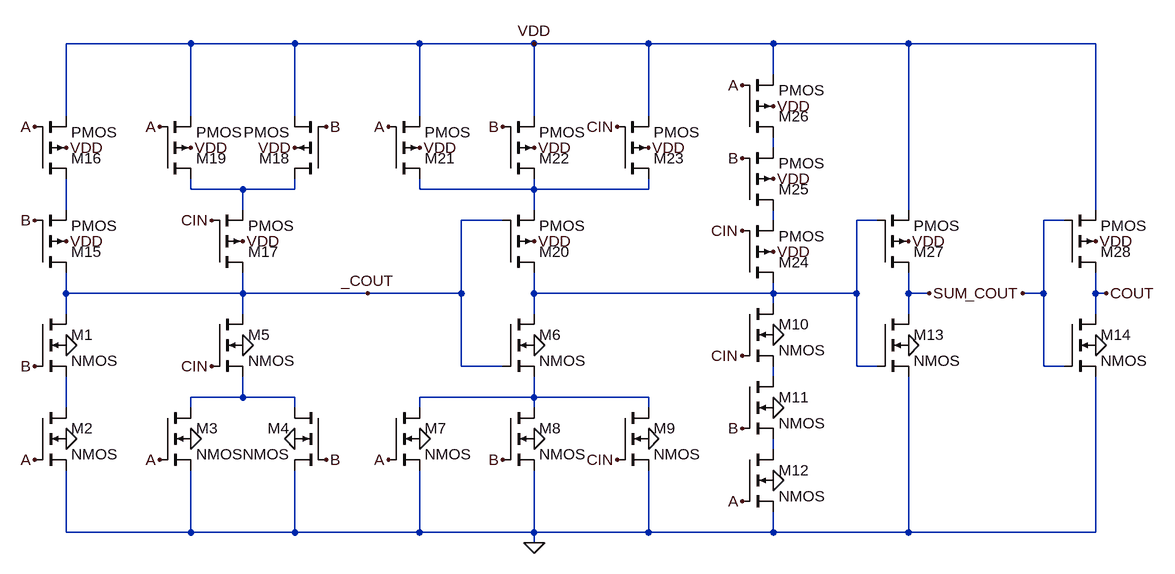
[diagram p0: schematic FA.asc]
FA.asc, the LTspice schematic file:
Version 4
SHEET 1 1760 680
WIRE -256 -368 -448 -368
WIRE -96 -368 -256 -368
WIRE 96 -368 -96 -368
WIRE 272 -368 96 -368
WIRE 448 -368 272 -368
WIRE 640 -368 448 -368
WIRE 848 -368 640 -368
WIRE 1136 -368 848 -368
WIRE 640 -320 640 -368
WIRE -448 -256 -448 -368
WIRE -256 -256 -256 -368
WIRE -96 -256 -96 -368
WIRE 96 -256 96 -368
WIRE 272 -256 272 -368
WIRE 448 -256 448 -368
WIRE 640 -208 640 -224
WIRE -256 -144 -256 -160
WIRE -176 -144 -256 -144
WIRE -96 -144 -96 -160
WIRE -96 -144 -176 -144
WIRE 96 -144 96 -160
WIRE 272 -144 272 -160
WIRE 272 -144 96 -144
WIRE 448 -144 448 -160
WIRE 448 -144 272 -144
WIRE -448 -112 -448 -160
WIRE -176 -112 -176 -144
WIRE 272 -112 272 -144
WIRE 848 -112 848 -368
WIRE 1136 -112 1136 -368
WIRE 224 -96 160 -96
WIRE 640 -96 640 -112
WIRE 800 -96 768 -96
WIRE 1088 -96 1056 -96
WIRE -448 16 -448 -16
WIRE -176 16 -176 -16
WIRE -176 16 -448 16
WIRE 16 16 -176 16
WIRE 160 16 160 -96
WIRE 160 16 16 16
WIRE 272 16 272 -16
WIRE 640 16 640 0
WIRE 640 16 272 16
WIRE 768 16 768 -96
WIRE 768 16 640 16
WIRE 848 16 848 -16
WIRE 880 16 848 16
WIRE 1056 16 1056 -96
WIRE 1056 16 1024 16
WIRE 1136 16 1136 -16
WIRE 1152 16 1136 16
WIRE 640 32 640 16
WIRE -448 48 -448 16
WIRE -176 48 -176 16
WIRE 272 48 272 16
WIRE 848 48 848 16
WIRE 1136 48 1136 16
WIRE 160 128 160 16
WIRE 224 128 160 128
WIRE 768 128 768 16
WIRE 800 128 768 128
WIRE 1056 128 1056 16
WIRE 1088 128 1056 128
WIRE 640 144 640 128
WIRE -176 176 -176 144
WIRE -176 176 -256 176
WIRE -96 176 -176 176
WIRE 272 176 272 144
WIRE 272 176 96 176
WIRE 448 176 272 176
WIRE -448 192 -448 144
WIRE -256 192 -256 176
WIRE -96 192 -96 176
WIRE 96 192 96 176
WIRE 272 192 272 176
WIRE 448 192 448 176
WIRE 640 256 640 240
WIRE -448 384 -448 288
WIRE -256 384 -256 288
WIRE -256 384 -448 384
WIRE -96 384 -96 288
WIRE -96 384 -256 384
WIRE 96 384 96 288
WIRE 96 384 -96 384
WIRE 272 384 272 288
WIRE 272 384 96 384
WIRE 448 384 448 288
WIRE 448 384 272 384
WIRE 640 384 640 352
WIRE 640 384 448 384
WIRE 848 384 848 144
WIRE 848 384 640 384
WIRE 1136 384 1136 144
WIRE 1136 384 848 384
WIRE 272 400 272 384
FLAG -496 272 A
FLAG -496 -240 A
FLAG -304 -240 A
FLAG -304 272 A
FLAG 48 272 A
FLAG 48 -240 A
FLAG 592 -304 A
FLAG 592 336 A
FLAG -496 128 B
FLAG -496 -96 B
FLAG -48 -240 B
FLAG -48 272 B
FLAG 224 272 B
FLAG 224 -240 B
FLAG 592 -192 B
FLAG 592 224 B
FLAG -224 -96 CIN
FLAG -224 128 CIN
FLAG 400 272 CIN
FLAG 400 -240 CIN
FLAG 592 -80 CIN
FLAG 592 112 CIN
FLAG -448 240 0
FLAG -448 96 0
FLAG -176 96 0
FLAG -256 240 0
FLAG -96 240 0
FLAG 96 240 0
FLAG 272 96 0
FLAG 448 240 0
FLAG 272 240 0
FLAG 640 304 0
FLAG 640 192 0
FLAG 640 80 0
FLAG 848 96 0
FLAG 1136 96 0
FLAG 272 -368 VDD
FLAG -448 -208 VDD
FLAG -448 -64 VDD
FLAG -176 -64 VDD
FLAG -256 -208 VDD
FLAG -96 -208 VDD
FLAG 96 -208 VDD
FLAG 272 -208 VDD
FLAG 448 -208 VDD
FLAG 272 -64 VDD
FLAG 640 -48 VDD
FLAG 640 -160 VDD
FLAG 640 -272 VDD
FLAG 848 -64 VDD
FLAG 1136 -64 VDD
FLAG 880 16 SUM
FLAG 1024 16 _COUT
FLAG 1152 16 COUT
FLAG 16 16 _COUT
FLAG 272 400 0
SYMBOL nmos4 -496 48 R0
SYMATTR InstName M1
SYMBOL nmos4 -496 192 R0
SYMATTR InstName M2
SYMBOL nmos4 -304 192 R0
SYMATTR InstName M3
SYMBOL nmos4 -48 192 M0
SYMATTR InstName M4
SYMBOL nmos4 -224 48 R0
SYMATTR InstName M5
SYMBOL nmos4 224 48 R0
SYMATTR InstName M6
SYMBOL nmos4 48 192 R0
SYMATTR InstName M7
SYMBOL nmos4 224 192 R0
SYMATTR InstName M8
SYMBOL nmos4 400 192 R0
SYMATTR InstName M9
SYMBOL nmos4 592 32 R0
SYMATTR InstName M10
SYMBOL nmos4 592 144 R0
SYMATTR InstName M11
SYMBOL nmos4 592 256 R0
SYMATTR InstName M12
SYMBOL nmos4 800 48 R0
SYMATTR InstName M13
SYMBOL nmos4 1088 48 R0
SYMATTR InstName M14
SYMBOL pmos4 -496 -16 M180
SYMATTR InstName M15
SYMBOL pmos4 -496 -160 M180
SYMATTR InstName M16
SYMBOL pmos4 -224 -16 M180
SYMATTR InstName M17
SYMBOL pmos4 -48 -160 R180
SYMATTR InstName M18
SYMBOL pmos4 -304 -160 M180
SYMATTR InstName M19
SYMBOL pmos4 224 -16 M180
SYMATTR InstName M20
SYMBOL pmos4 48 -160 M180
SYMATTR InstName M21
SYMBOL pmos4 224 -160 M180
SYMATTR InstName M22
SYMBOL pmos4 400 -160 M180
SYMATTR InstName M23
SYMBOL pmos4 592 0 M180
SYMATTR InstName M24
SYMBOL pmos4 592 -112 M180
SYMATTR InstName M25
SYMBOL pmos4 592 -224 M180
SYMATTR InstName M26
SYMBOL pmos4 800 -16 M180
SYMATTR InstName M27
SYMBOL pmos4 1088 -16 M180
SYMATTR InstName M28

The netlist it stands for:
* FA.asc
M1 _COUT B N010 0 NMOS
M2 N010 A 0 0 NMOS
M3 N008 A 0 0 NMOS
M4 N008 B 0 0 NMOS
M5 _COUT CIN N008 0 NMOS
M6 N006 _COUT N009 0 NMOS
M7 N009 A 0 0 NMOS
M8 N009 B 0 0 NMOS
M9 N009 CIN 0 0 NMOS
M10 N006 CIN N007 0 NMOS
M11 N007 B N011 0 NMOS
M12 N011 A 0 0 NMOS
M13 SUM N006 0 0 NMOS
M14 COUT _COUT 0 0 NMOS
M15 _COUT B N004 VDD PMOS
M16 N004 A VDD VDD PMOS
M17 _COUT CIN N002 VDD PMOS
M18 N002 B VDD VDD PMOS
M19 N002 A VDD VDD PMOS
M20 N006 _COUT N003 VDD PMOS
M21 N003 A VDD VDD PMOS
M22 N003 B VDD VDD PMOS
M23 N003 CIN VDD VDD PMOS
M24 N006 CIN N005 VDD PMOS
M25 N005 B N001 VDD PMOS
M26 N001 A VDD VDD PMOS
M27 SUM N006 VDD VDD PMOS
M28 COUT _COUT VDD VDD PMOS
.model NMOS NMOS
.model PMOS PMOS
.lib standard.mos
.backanno
.end